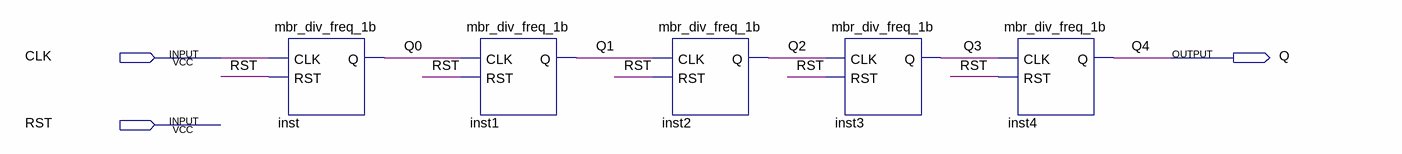
[diagram p0: schematic sheet]
// Quartus schematic mbr_div_freq_5b.bdf as structural Verilog: 5 symbols, 3 pins
module mbr_div_freq_5b (
  input  CLK,
  input  RST,
  output Q
);

  wire Q0, Q1, Q2, Q3;

  mbr_div_freq_1b inst (.CLK(CLK), .RST(RST), .Q(Q0));
  mbr_div_freq_1b inst1 (.CLK(Q0), .RST(RST), .Q(Q1));
  mbr_div_freq_1b inst2 (.CLK(Q1), .RST(RST), .Q(Q2));
  mbr_div_freq_1b inst3 (.CLK(Q2), .RST(RST), .Q(Q3));
  mbr_div_freq_1b inst4 (.CLK(Q3), .RST(RST), .Q(Q));

  // Other names for the same wires on the sheet: Q4 = Q
endmodule
